# Altium schematic sheet Connector&Power.SchDoc
size A4
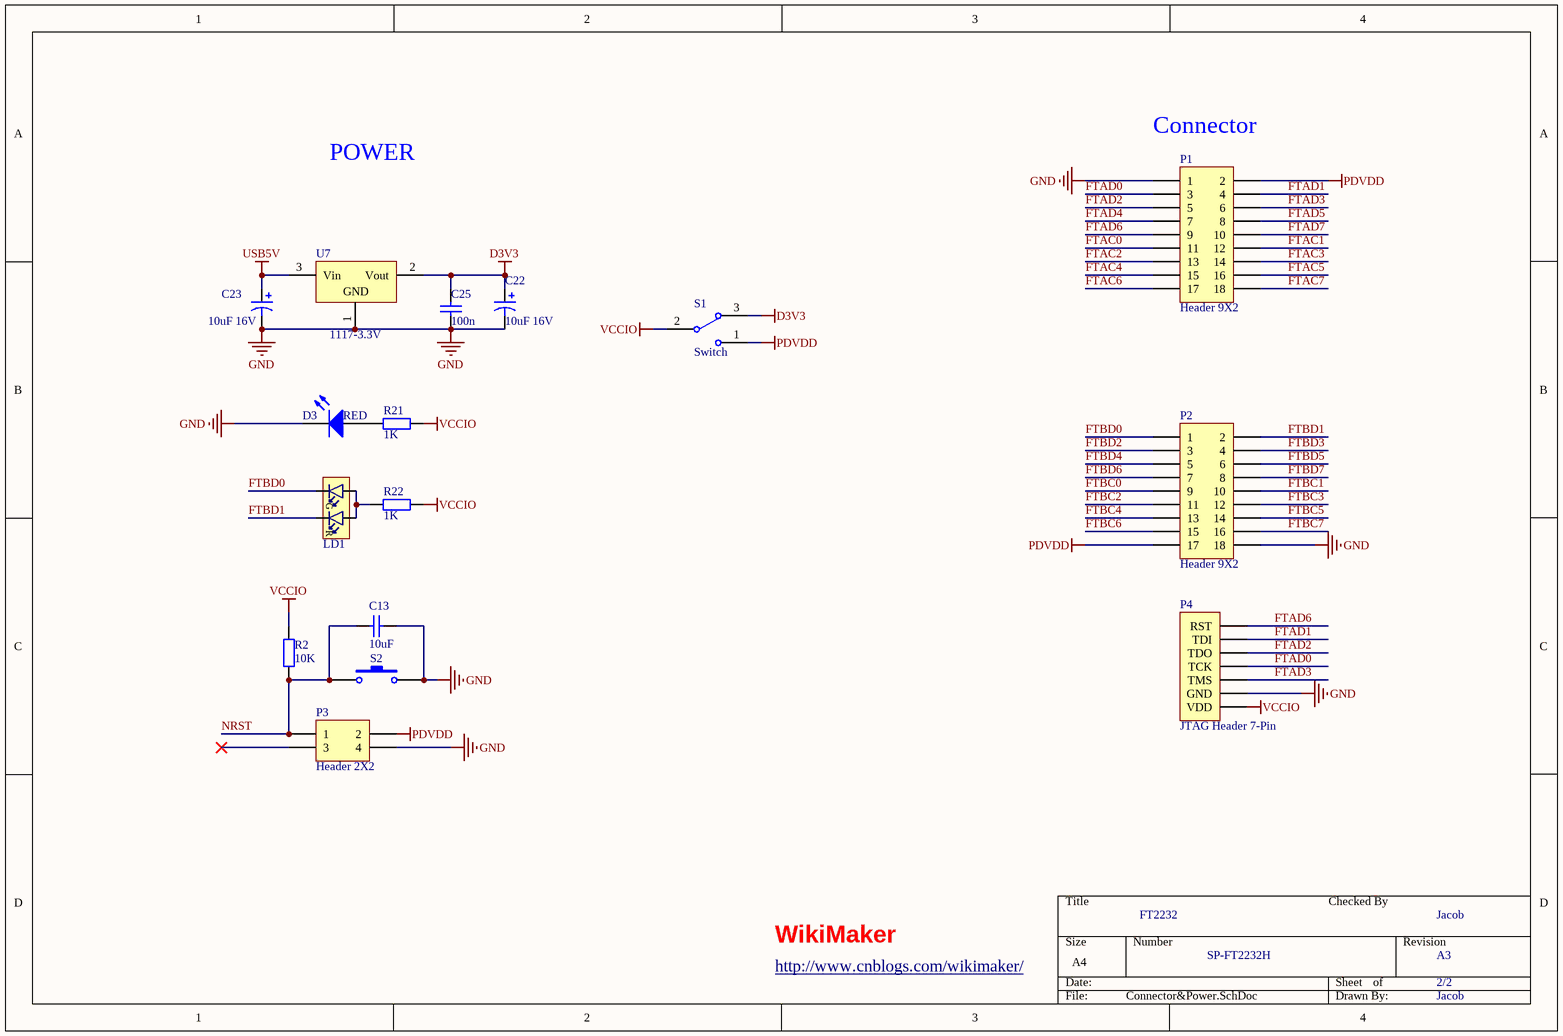
[diagram p0: Connector&Power.SchDoc]

## Parts
C13  10uF  [0603L]
C22  10uF 16V  [1206]
C23  10uF 16V  [1206]
C25  100n  [0603M]
D3  RED  [0603pn]
LD1  LTST-C195KGJRKT  [0805-LED-Bi]  (value not drawn)
P1  Header 9X2  [HDR2X9/2.54MM]
P2  Header 9X2  [HDR2X9/2.54MM]
P3  Header 2X2  [HDR2X2/2.54MM]
P4  JTAG Header 7-Pin  [HDR1X7/2.54MM]
R2  10K  [0603L]
R21  1K  [0603M]
R22  1K  [0603M]
S1  Switch  [HDR1X3/2.54mm]
S2  (no value)  [KEY-2x4-SMD]
U7  1117-3.3V  [SOT-223]

## Nets
D3V3: C22.1 C25.2 S1.3 U7.2(Vout)
GND: C13.1 C22.2 C23.2 C25.1 D3.2(K) P1.1 P2.18 P3.4 P4.2(GND) S2.1 U7.1(GND/ADJUST)
PDVDD: P1.2 P2.17 P3.2 S1.1
USB5V: C23.1 U7.3(Vin)
VCCIO: P4.1(VDD) R2.1 R21.1 R22.1 S1.2
FTAC0: P1.11
FTAC1: P1.12
FTAC2: P1.13
FTAC3: P1.14
FTAC4: P1.15
FTAC5: P1.16
FTAC6: P1.17
FTAC7: P1.18
FTAD0: P1.3 P4.4(TCK)
FTAD1: P1.4 P4.6(TDI)
FTAD2: P1.5 P4.5(TDO)
FTAD3: P1.6 P4.3(TMS)
FTAD4: P1.7
FTAD5: P1.8
FTAD6: P1.9 P4.7(RST)
FTAD7: P1.10
FTBC0: P2.9
FTBC1: P2.10
FTBC2: P2.11
FTBC3: P2.12
FTBC4: P2.13
FTBC5: P2.14
FTBC6: P2.15
FTBC7: P2.16
FTBD0: LD1.1(C1) P2.1
FTBD1: LD1.2(C2) P2.2
FTBD2: P2.3
FTBD3: P2.4
FTBD4: P2.5
FTBD5: P2.6
FTBD6: P2.7
FTBD7: P2.8
NRST: C13.2 P3.1 R2.2 S2.2
NetD3_1: D3.1(A) R21.2
NetLD1_3: LD1.3(A2) LD1.4(A1) R22.2

Not connected (* = marked no-connect by the designer): P3 3*

## Notes on the sheet
- POWER
- (near P1) Connector
- FT2232
- Checked By
- Jacob
- http://www.cnblogs.com/wikimaker/
- WikiMaker
- SP-FT2232H
- A3
- 2/2
- (in symbol 1117) GND
- (in symbol LED-DUAL) G; R

## Library data of the parts
C13 C25 = Cap: Capacitor; Published: 8-Jun-2000; LatestRevisionDate: 17-Jul-2002; LatestRevisionNote: Re-released for DXP Platform.; PackageReference: RAD-0.3; Publisher: Altium Limited
  C13: Value: 10uF
  C25: PackageDescription: Radial Cap, Thru-Hole; 2 Leads; 0.3 in Pin Spacing; Value: 100n
C22 C23 = Cap Pol1: Polarized Capacitor (Radial); Published: 8-Jun-2000; LatestRevisionDate: 17-Jul-2002; LatestRevisionNote: Re-released for DXP Platform.; PackageReference: RB7.6-15; Publisher: Altium Limited; PackageDescription: Polarized Capacitor (Radial); 2 Leads
D3 = LED0: Typical INFRARED GaAs LED; Published: 8-Jun-2000; LatestRevisionDate: 08-Jul-2005; LatestRevisionNote: Mech Layer 1 removed.; PackageReference: LED-0; Publisher: Altium Limited
LD1 = LED-DUAL: Avago, HSMF-A203 Bi-Color LED; Manufacturer: Lite-On Inc; 2nd source part number: 859-LTST-C195KGJRKT; Note: HSMF-A203- xxxxx GaP Red GaP Emerald Green; Artikkelnr Noca: 13019145; Part Number: LTST-C195KGJRKT; Manufacturer Part Number: LTST-C195KGJRKT; Datasheet: http://media.digikey.com/pdf/Data%20Sheets/Lite-On%20PDFs/LTST-C195KGJRKT.pdf; Footprint: LED_DUAL_0606; LatestRevisionDate: 2012-07-05; Pin Count: 4; Publisher: Nordic Semiconductor; Published: 2012-07-05; Value: LTST-C195KGJRKT; Supplier: Digi-Key; Supplier part number: 160-1452-1-ND; 2nd source Supplier: Mouser
P1 P2 = Header 9X2: Header, 9-Pin, Dual row; LatestRevisionDate: 17-Jul-2002; LatestRevisionNote: Re-released for DXP Platform.; Publisher: Altium Limited
P3 = Header 2X2: Header, 2-Pin, Dual row; LatestRevisionDate: 17-Jul-2002; LatestRevisionNote: Re-released for DXP Platform.; Publisher: Altium Limited
P4 = JTAG Header 7-Pin: Header, 7-Pin; LatestRevisionDate: 17-Jul-2002; LatestRevisionNote: Re-released for DXP Platform.; Publisher: Altium Limited
R2 R21 R22 = Res2: Resistor; Published: 8-Jun-2000; LatestRevisionDate: 17-Jul-2002; LatestRevisionNote: Re-released for DXP Platform.; PackageReference: AXIAL-0.4; Publisher: Altium Limited
  R2: Value: 10K
  R21 R22: Value: 1K
S1 = SW-SPDT: SPDT Subminiature Toggle Switch, Right Angle Mounting, Vertical Actuation; Published: 24-Mar-1999; LatestRevisionDate: 17-Dec-2003; LatestRevisionNote: Schematic revised, PCB Footprint replaced.; DatasheetVersion: 05-Dec-2000; PackageReference: TL36WW15050; Publisher: Altium Limited; PackageDescription: Switch; 4 Leads; ComponentLink1Description: Manufacturer Link; ComponentLink1URL: http://www.apem.com
S2 = SW-PB: Switch; Published: 24-Mar-1999; LatestRevisionDate: 17-Jul-2002; LatestRevisionNote: Re-released for DXP Platform.; PackageReference: SPST-2; Publisher: Altium Limited
U7 = 1117: 1117- 3.3 2.5 1.8; Published: 24-Mar-1999; LatestRevisionDate: 29-May-2009; LatestRevisionNote: IPC-7351 Footprint Added.; PackageReference: D2PAK; Publisher: Altium Limited; PackageDescription: 3-Pin Transistor Outline Package 2.54 mm Pitch, 15.1 mm Lead Span